# Altium schematic sheet [01] - Block Diagram.SchDoc: =ProjectName
size A4; CheckedBy: Ven; Author: Ven; CompanyName: HUST; Revision: V.1.0
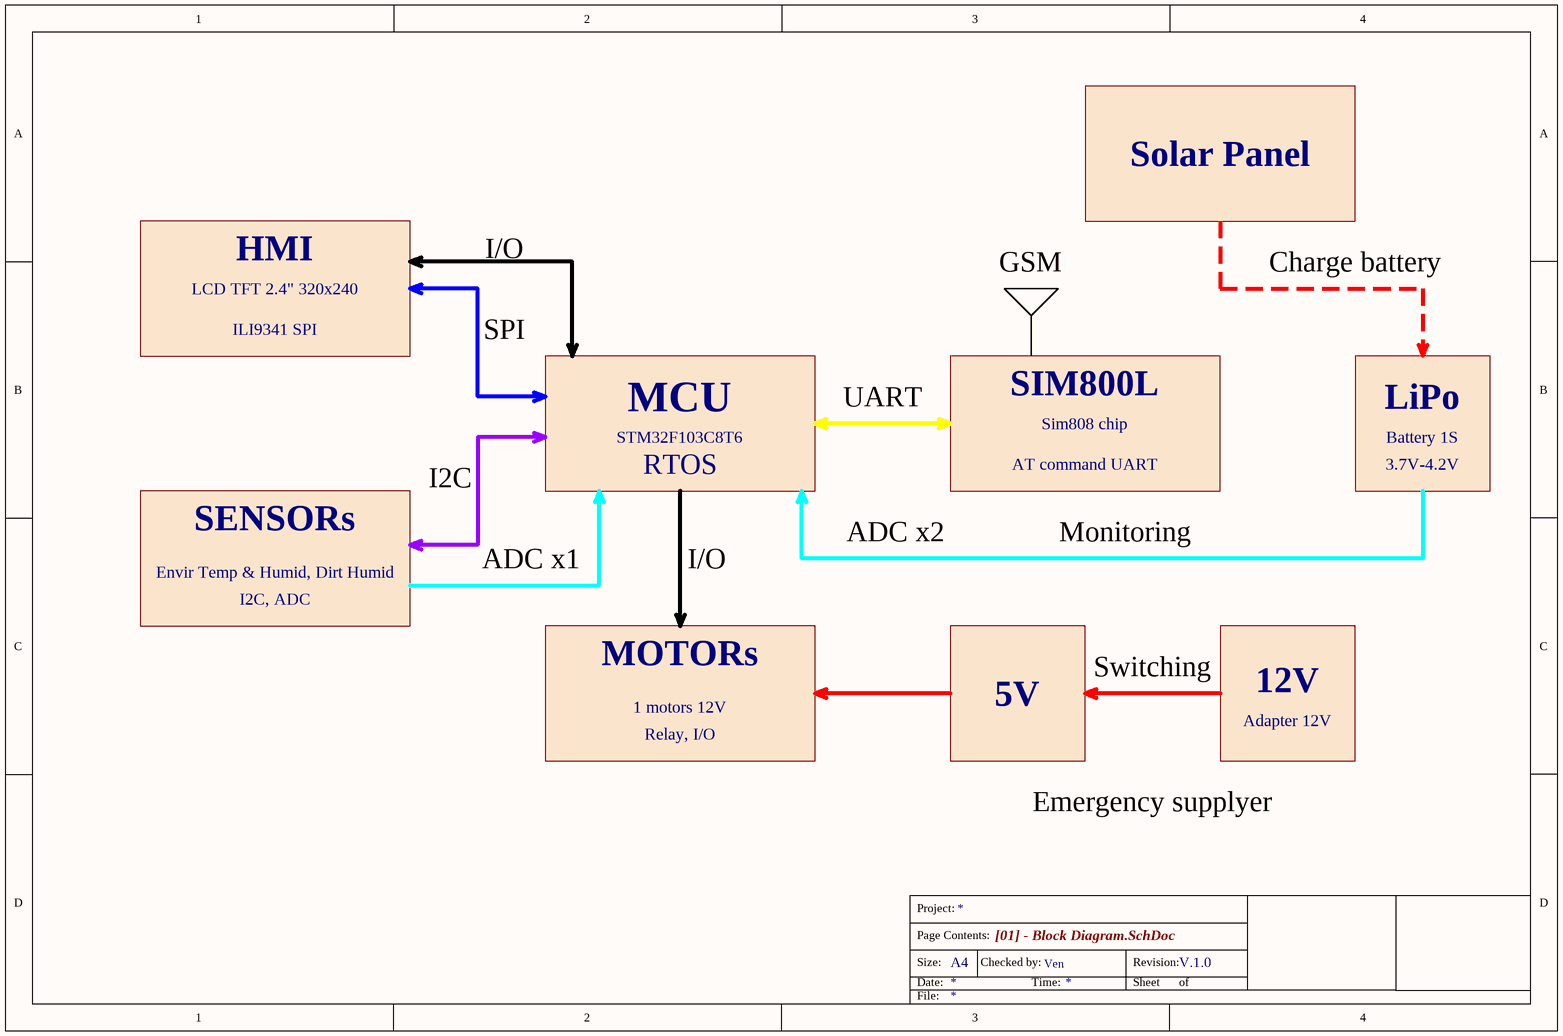
[diagram p0: [01] - Block Diagram.SchDoc]

## Notes on the sheet
- Solar Panel
- HMI
- I/O
- LCD TFT 2.4" 320x240
- GSM
- Charge battery
- ILI9341 SPI
- SPI
- SIM800L
- MCU
- STM32F103C8T6
- UART
- Sim808 chip
- LiPo
- Battery 1S
- SENSORs
- I2C
- RTOS
- AT command UART
- 3.7V-4.2V
- Envir Temp & Humid, Dirt Humid
- ADC x1
- ADC x2
- Monitoring
- I2C, ADC
- MOTORs
- 1 motors 12V
- 5V
- Switching
- 12V
- Adapter 12V
- Relay, I/O
- Emergency supplyer
- Project:
- Page Contents:
- Size:
- Date:
- A4
- Checked by:
- Time:
- Revision:
- Sheet
- of
- File: